# Altium project Control_IR_Raspberry.PrjPcb
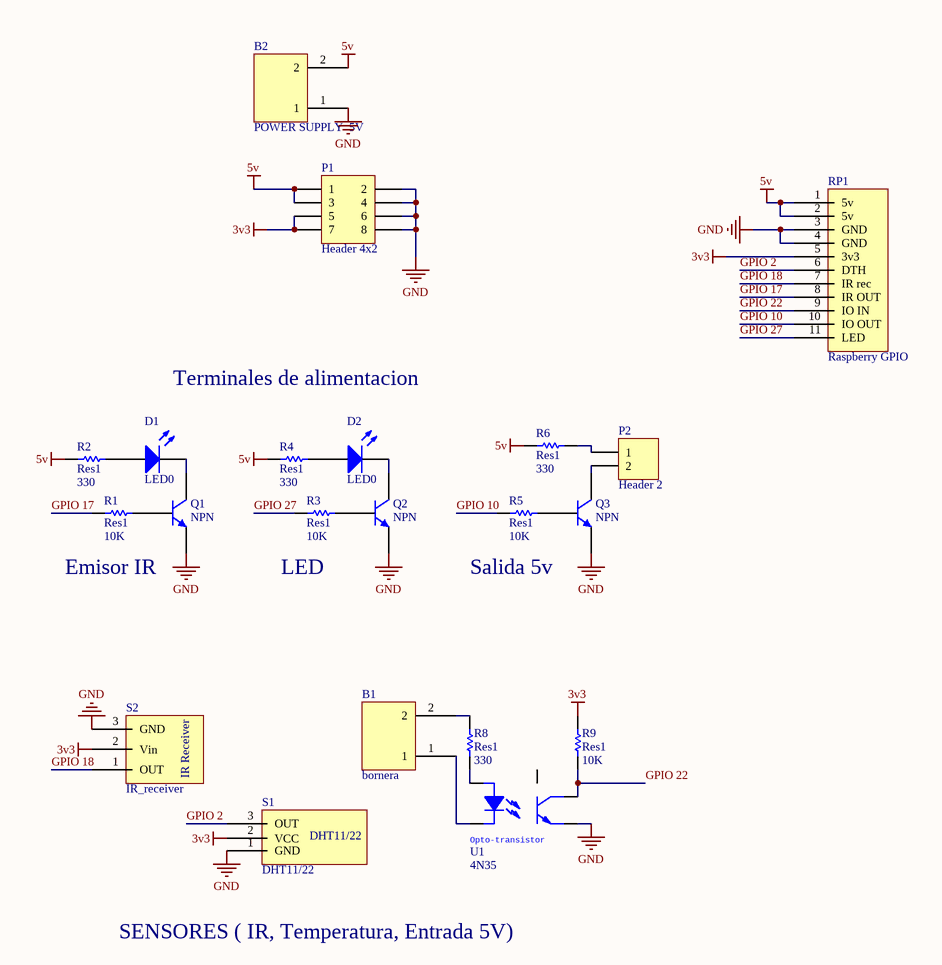
[diagram p0: Control_IR_Raspberry.SchDoc]
1 sheet, 21 parts. Net scope: global (net labels, ports and power ports of the same name join across sheets).
Board file: Control_IR_Raspberry.PcbDoc

## Sheet Control_IR_Raspberry.SchDoc
size A4

### Parts
B1  bornera  [bornera chica]
B2  POWER SUPPLY  5V  [bornera chica]
D1  LED0  [led5mm]
D2  LED0  [led5mm]
P1  Header 4x2  [Header 4x2]
P2  Header 2  [Header 2]
Q1  NPN  [TO92]
Q2  NPN  [TO92]
Q3  NPN  [TO92]
R1  Res1  value 10K  [AXIAL-0.3]
R2  Res1  value 330  [AXIAL-0.3]
R3  Res1  value 10K  [AXIAL-0.3]
R4  Res1  value 330  [AXIAL-0.3]
R5  Res1  value 10K  [AXIAL-0.3]
R6  Res1  value 330  [AXIAL-0.3]
R8  Res1  value 330  [AXIAL-0.3]
R9  Res1  value 10K  [AXIAL-0.3]
RP1  Raspberry GPIO  [entradas de placa]
S1  DHT11/22  [Header 3]
S2  IR_receiver  [Header 3]
U1  4N35  [DIP6]

### Nets
3v3: P1.5 P1.7 R9.2 RP1.5(3v3) S1.2(VCC) S2.2(Vin)
5v: B2.2 P1.1 P1.3 R2.1 R4.2 R6.2 RP1.1(5v) RP1.2(5v)
GND: B2.1 P1.2 P1.4 P1.6 P1.8 Q1.3(E) Q2.3(E) Q3.3(E) RP1.3(GND) RP1.4(GND) S1.1(GND) S2.3(GND) U1.4
GPIO 2: RP1.6(DTH) S1.3(OUT)
GPIO 10: R5.1 RP1.10(IO_OUT)
GPIO 17: R1.1 RP1.8(IR_OUT)
GPIO 18: RP1.7(IR_rec) S2.1(OUT)
GPIO 22: R9.1 RP1.9(IO_IN) U1.5
GPIO 27: R3.1 RP1.11(LED)
NetB1_1: B1.1 U1.2
NetB1_2: B1.2 R8.2
NetD1_1: D1.1(A) R2.2
NetD1_2: D1.2(K) Q1.1(C)
NetD2_1: D2.1(A) R4.1
NetD2_2: D2.2(K) Q2.1(C)
NetP2_1: P2.1 R6.1
NetP2_2: P2.2 Q3.1(C)
NetQ1_2: Q1.2(B) R1.2
NetQ2_2: Q2.2(B) R3.2
NetQ3_2: Q3.2(B) R5.2
NetR8_1: R8.1 U1.1

Not connected (* = marked no-connect by the designer): U1 6

### Notes on the sheet
- Terminales de alimentacion
- Emisor IR
- LED
- Salida 5v
- SENSORES ( IR, Temperatura, Entrada 5V)
- (in symbol 4N35) Opto-transistor
- (in symbol IR_receiver) IR Receiver

### Library data of the parts
B2 = bornera
D1 D2 = LED0: Typical INFRARED GaAs LED; Published: 8-Jun-2000; LatestRevisionDate: 08-Jul-2005; LatestRevisionNote: Mech Layer 1 removed.; PackageReference: LED-0; Publisher: Altium Limited; PackageDescription: LED; 2 Leads
P1 = Header 4x2: Header, 8-Pin, 2-Row; LatestRevisionDate: 17-Jul-2002; LatestRevisionNote: Re-released for DXP Platform.; Publisher: Altium Limited
P2 = Header 2: Header, 2-Pin; LatestRevisionDate: 17-Jul-2002; LatestRevisionNote: Re-released for DXP Platform.; Publisher: Altium Limited
Q1-Q3 = NPN: NPN Bipolar Transistor; Published: 8-Jun-2000; LatestRevisionDate: 17-Jul-2002; LatestRevisionNote: Re-released for DXP Platform.; PackageReference: TO-226-AA; Publisher: Altium Limited; PackageDescription: TO, Flat Index; 3 In-Line, Axial Leads; Body Dia. 4.8mm; Leads 0.55 x 0.51 mm (max); Code_JEDEC: TO-226-AA
R1-R6 R8 R9 = Res1: Resistor; Published: 8-Jun-2000; LatestRevisionDate: 17-Jul-2002; LatestRevisionNote: Re-released for DXP Platform.; PackageReference: AXIAL-0.3; Publisher: Altium Limited; PackageDescription: Axial Device, Thru-Hole; 2 Leads; 0.3 in Pin Spacing
U1 = 4N35: Opto Couple; Vendor: Digikey; Published: 13-April-2009; Publisher: Hoang Nguyen; ComponentLink1Description: Digikey Part Link; ComponentLink2Description: Open Datasheet; ComponentLink2URL: H:\LIBRARY\LIBRARY.Datasheet\